# Altium schematic sheet Connectors.SchDoc
size A3; SheetNumber: 5; SheetTotal: 6
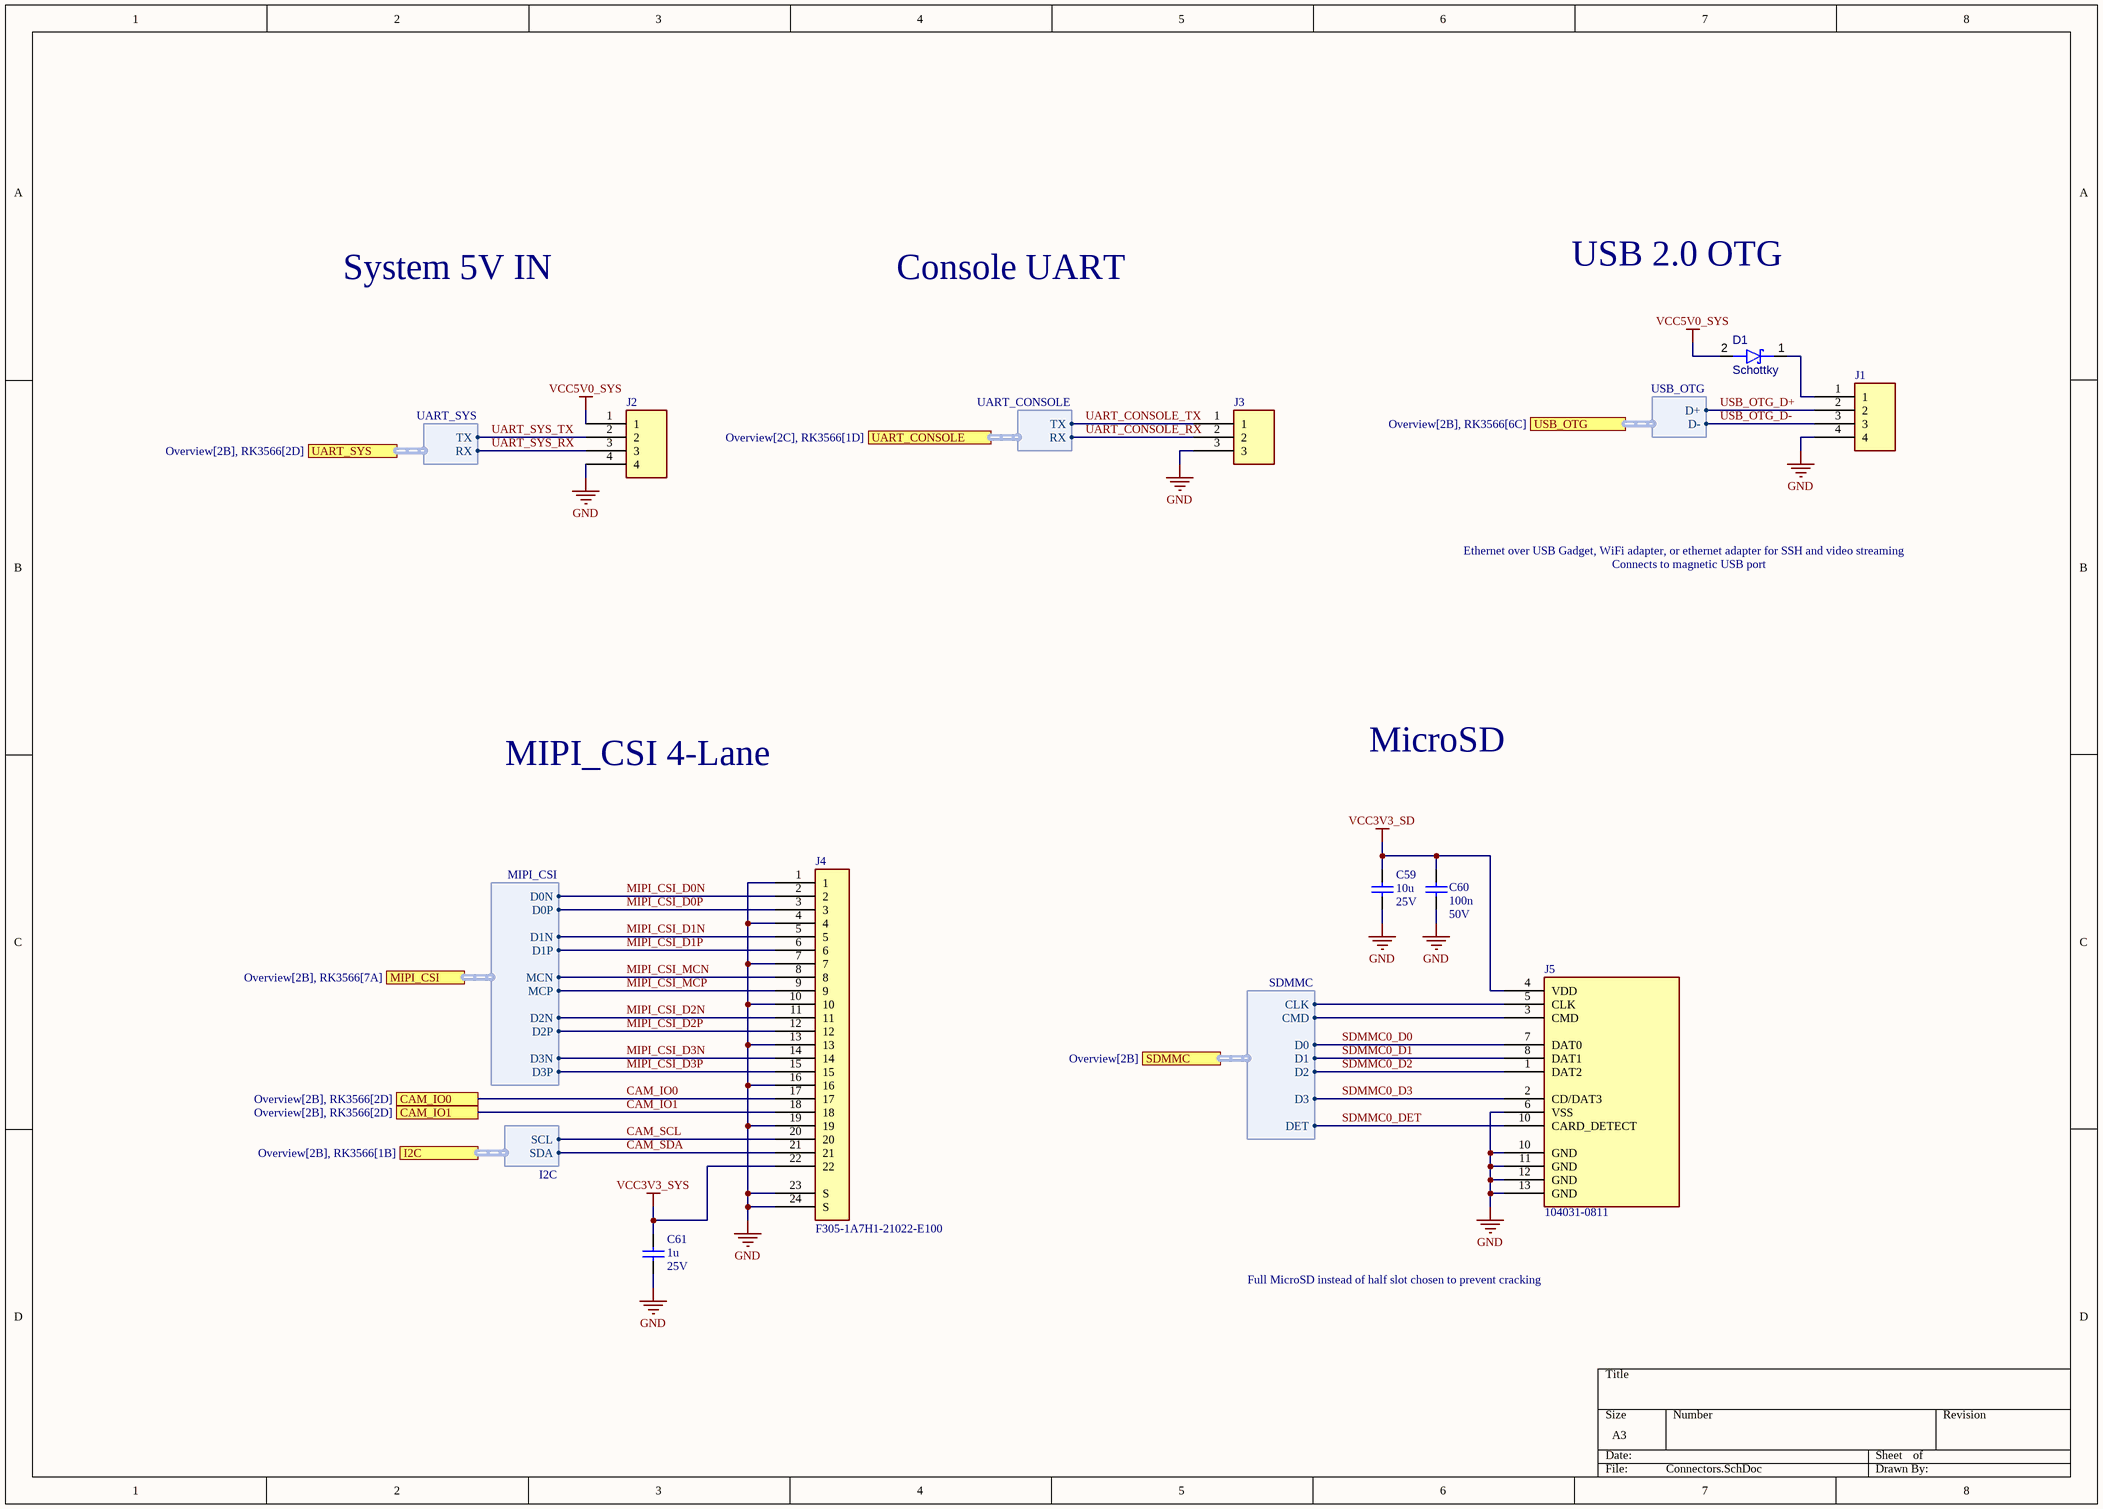
[diagram p0: Connectors.SchDoc]

## Parts
C59  value 10u  Voltage: 25V  (hidden comment: GRM188R61E106MA73D)
C60  value 100n  Voltage: 50V  [GRM155R71H104KE14D]  (hidden comment: GRM155R71H104KE14D)
C61  value 1u  Voltage: 25V  [GRM155R61E105KA12D]  (hidden comment: GRM155R61E105KA12D)
D1  Schottky  [MicroSMP (DO-219AD)]
J1  SM04B-SRSS-TB  [SM04B-SRSS-TB]  (value not drawn)
J2  SM04B-SRSS-TB  [SM04B-SRSS-TB]  (value not drawn)
J3  SM03B-SRSS-TB  [SM03B-SRSS-TB]  (value not drawn)
J4  F305-1A7H1-21022-E100  [F305-1A7H1-21022-E100]
J5  104031-0811  [104031-0811]

## Ports
CAM_IO0 (see Overview[2B], RK3566[2D]), CAM_IO1 (see Overview[2B], RK3566[2D]), I2C (harness I2C, see Overview[2B], RK3566[1B]), MIPI_CSI (harness MIPI_CSI, see Overview[2B], RK3566[7A]), SDMMC (harness SDMMC, see Overview[2B]), UART_CONSOLE (harness UART_CONSOLE, see Overview[2C], RK3566[1D]), UART_SYS (harness UART_SYS, see Overview[2B], RK3566[2D]), USB_OTG (harness USB_OTG, see Overview[2B], RK3566[6C])

## Harnesses
USB_OTG: D+, D-
MIPI_CSI: D0N, D0P, MCN, MCP, D1P, D1N, D2N, D2P, D3N, D3P
SDMMC: CLK, CMD, D0, D1, D3, D2, DET
UART_SYS: TX, RX
UART_CONSOLE: TX, RX
I2C: SCL, SDA

## Nets
GND: C59.2 C60.2 C61.2 J1.4 J2.4 J3.3 J4.1 J4.4 J4.7 J4.10 J4.13 J4.16 J4.19 J4.23(S) J4.24(S) J5.6(VSS) J5.10(GND) J5.11(GND) J5.12(GND) J5.13(GND)
VCC3V3_SD: C59.1 C60.1 J5.4(VDD)
VCC3V3_SYS: C61.1 J4.22
VCC5V0_SYS: D1.2(A) J2.1
CAM_IO0: J4.17 ; port CAM_IO0
CAM_IO1: J4.18 ; port CAM_IO1
CAM_SCL: J4.20 ; port I2C.SCL
CAM_SDA: J4.21 ; port I2C.SDA
MIPI_CSI_D0N: J4.2 ; port MIPI_CSI.D0N
MIPI_CSI_D0P: J4.3 ; port MIPI_CSI.D0P
MIPI_CSI_D1N: J4.5 ; port MIPI_CSI.D1N
MIPI_CSI_D1P: J4.6 ; port MIPI_CSI.D1P
MIPI_CSI_D2N: J4.11 ; port MIPI_CSI.D2N
MIPI_CSI_D2P: J4.12 ; port MIPI_CSI.D2P
MIPI_CSI_D3N: J4.14 ; port MIPI_CSI.D3N
MIPI_CSI_D3P: J4.15 ; port MIPI_CSI.D3P
MIPI_CSI_MCN: J4.8 ; port MIPI_CSI.MCN
MIPI_CSI_MCP: J4.9 ; port MIPI_CSI.MCP
SDMMC0_D0: J5.7(DAT0) ; port SDMMC.D0
SDMMC0_D1: J5.8(DAT1) ; port SDMMC.D1
SDMMC0_D2: J5.1(DAT2) ; port SDMMC.D2
SDMMC0_D3: J5.2(CD/DAT3) ; port SDMMC.D3
SDMMC0_DET: J5.10(CARD_DETECT) ; port SDMMC.DET
UART_CONSOLE_RX: J3.2 ; port UART_CONSOLE.RX
UART_CONSOLE_TX: J3.1 ; port UART_CONSOLE.TX
UART_SYS_RX: J2.3 ; port UART_SYS.RX
UART_SYS_TX: J2.2 ; port UART_SYS.TX
USB_OTG_D+: J1.2 ; port USB_OTG.D+
USB_OTG_D-: J1.3 ; port USB_OTG.D-
NetD1_1: D1.1(K) J1.1
NetJ5_3: J5.3(CMD) ; port SDMMC.CMD
NetJ5_5: J5.5(CLK) ; port SDMMC.CLK

## Notes on the sheet
- System 5V IN
- Console UART
- USB 2.0 OTG
- Ethernet over USB Gadget, WiFi adapter, or ethernet adapter for SSH and video streaming
- Connects to magnetic USB port
- MIPI_CSI 4-Lane
- MicroSD
- Full MicroSD instead of half slot chosen to prevent cracking

## Library data of the parts
C59 = GRM188R61E106MA73D: CAP 10U 25V X5R 0603; Size: 0603; Dielectric: X5R
C60 = GRM155R71H104KE14D: CAP 100N 50V X7R 0402; Size: 0402; Dielectric: X7R; Manufacturer Part Number 1: GRM155R71H104KE14D
C61 = GRM155R61E105KA12D: CAP 1U 25V X5R 0402; Size: 0402; Dielectric: X5R; Manufacturer Part Number 1: GRM155R61E105KA12D
D1 = Schottky: Diode
J1 J2 = SM04B-SRSS-TB: JST-SH 4P; Manufacturer Part Number 1: SM04B-SRSS-TB
J3 = SM03B-SRSS-TB: JST-SH 3P; Manufacturer Part Number 1: SM03B-SRSS-TB
J4 = F305-1A7H1-21022-E100: FPC
J5 = 104031-0811: Micro SD